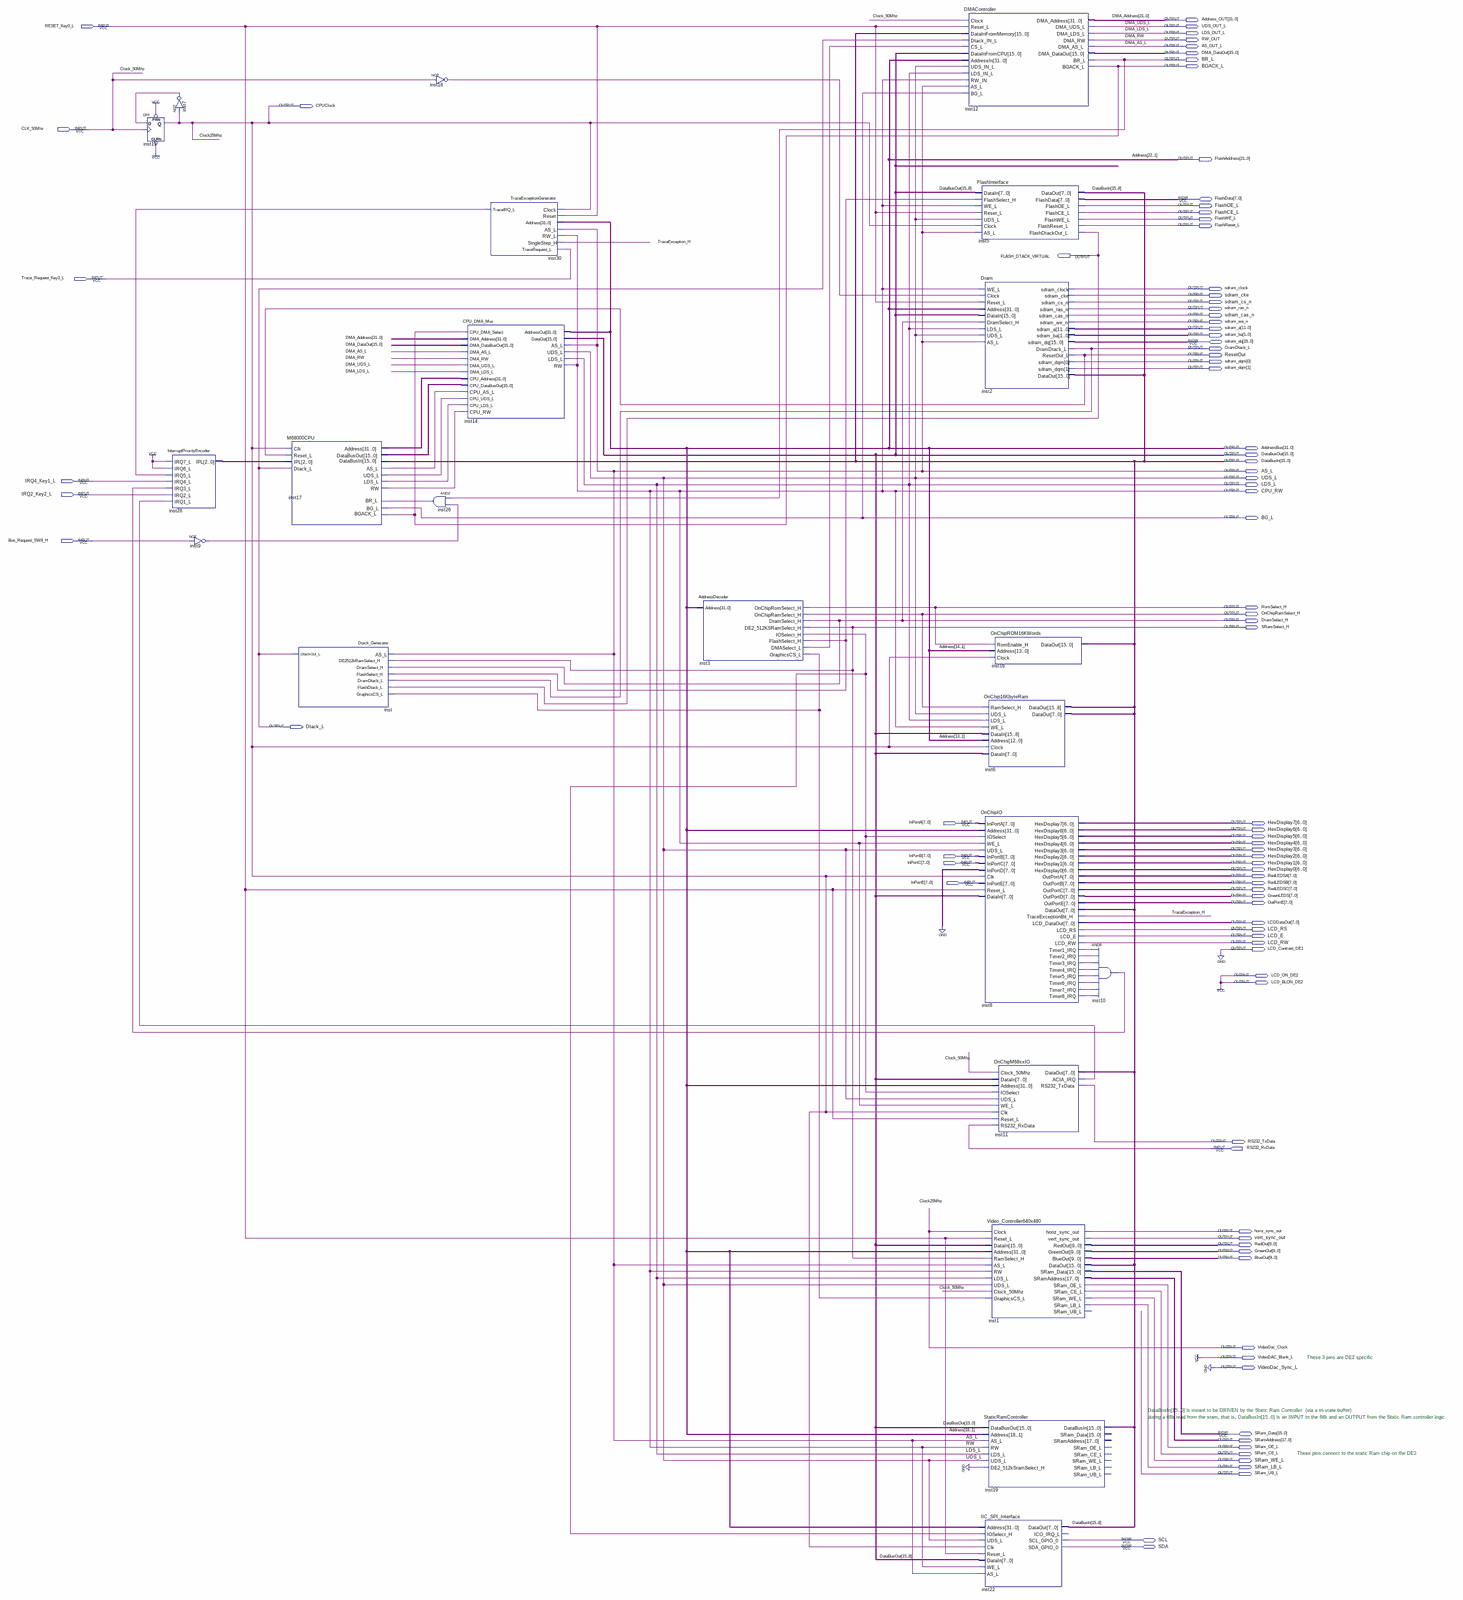
[diagram p0: schematic sheet, whole]
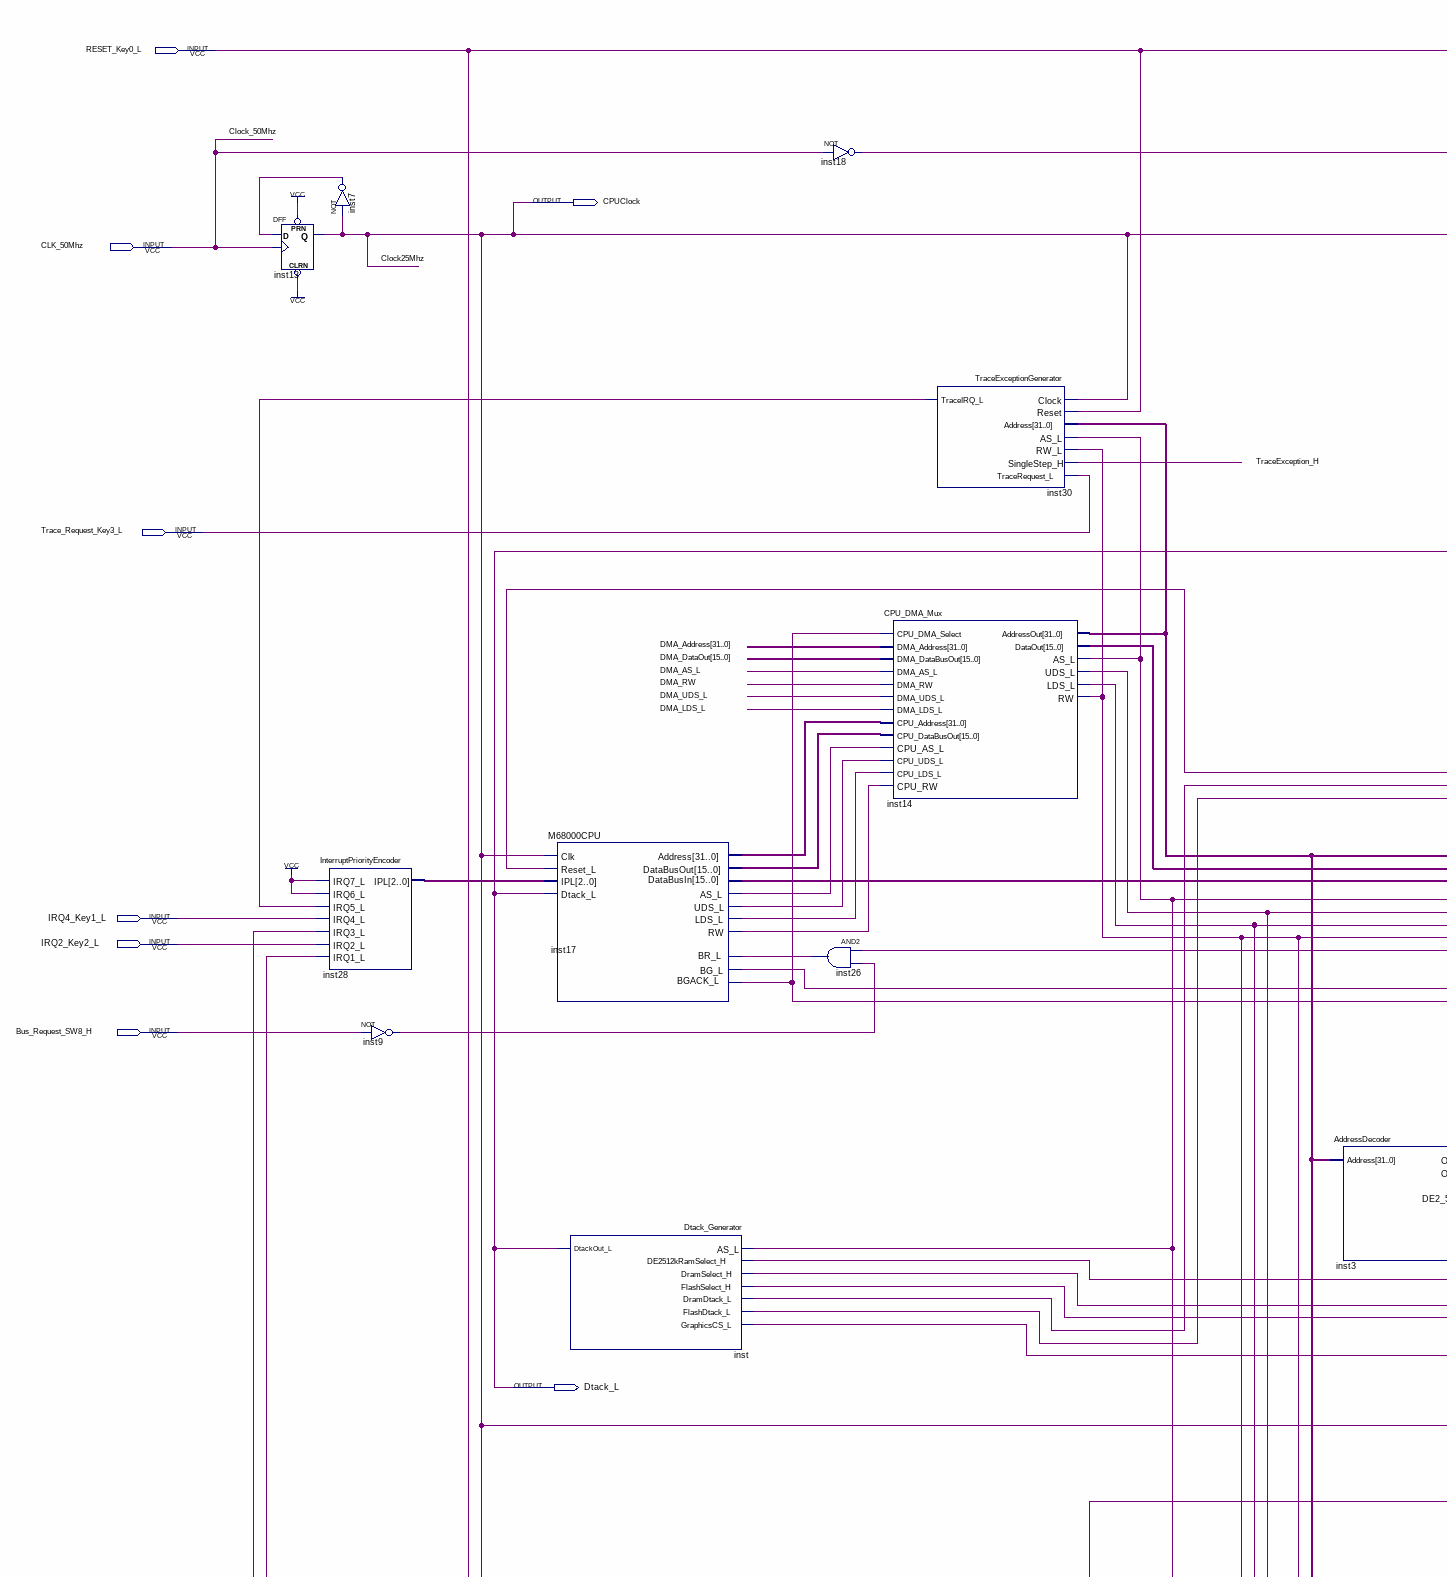
[diagram p1: schematic sheet, upper left part]
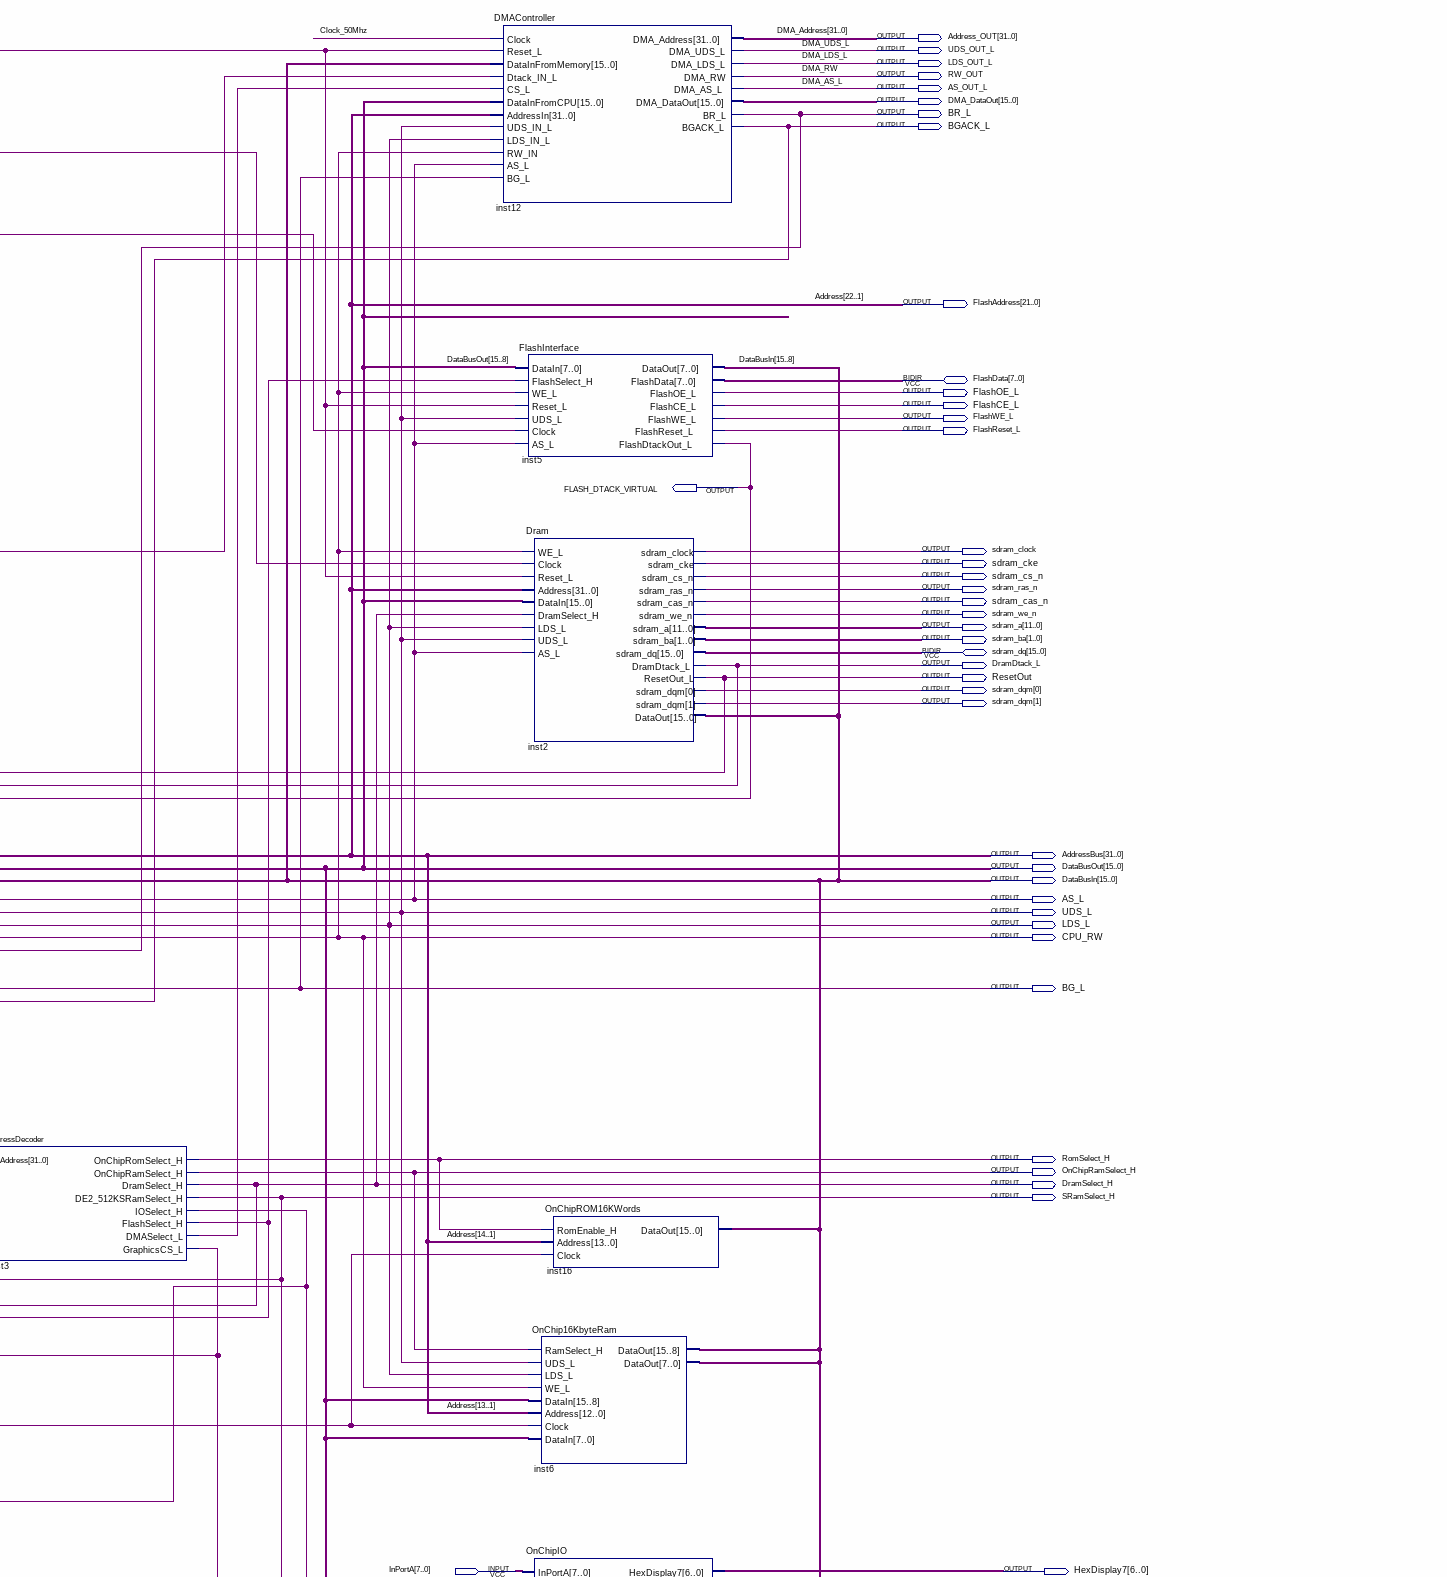
[diagram p2: schematic sheet, upper right part]
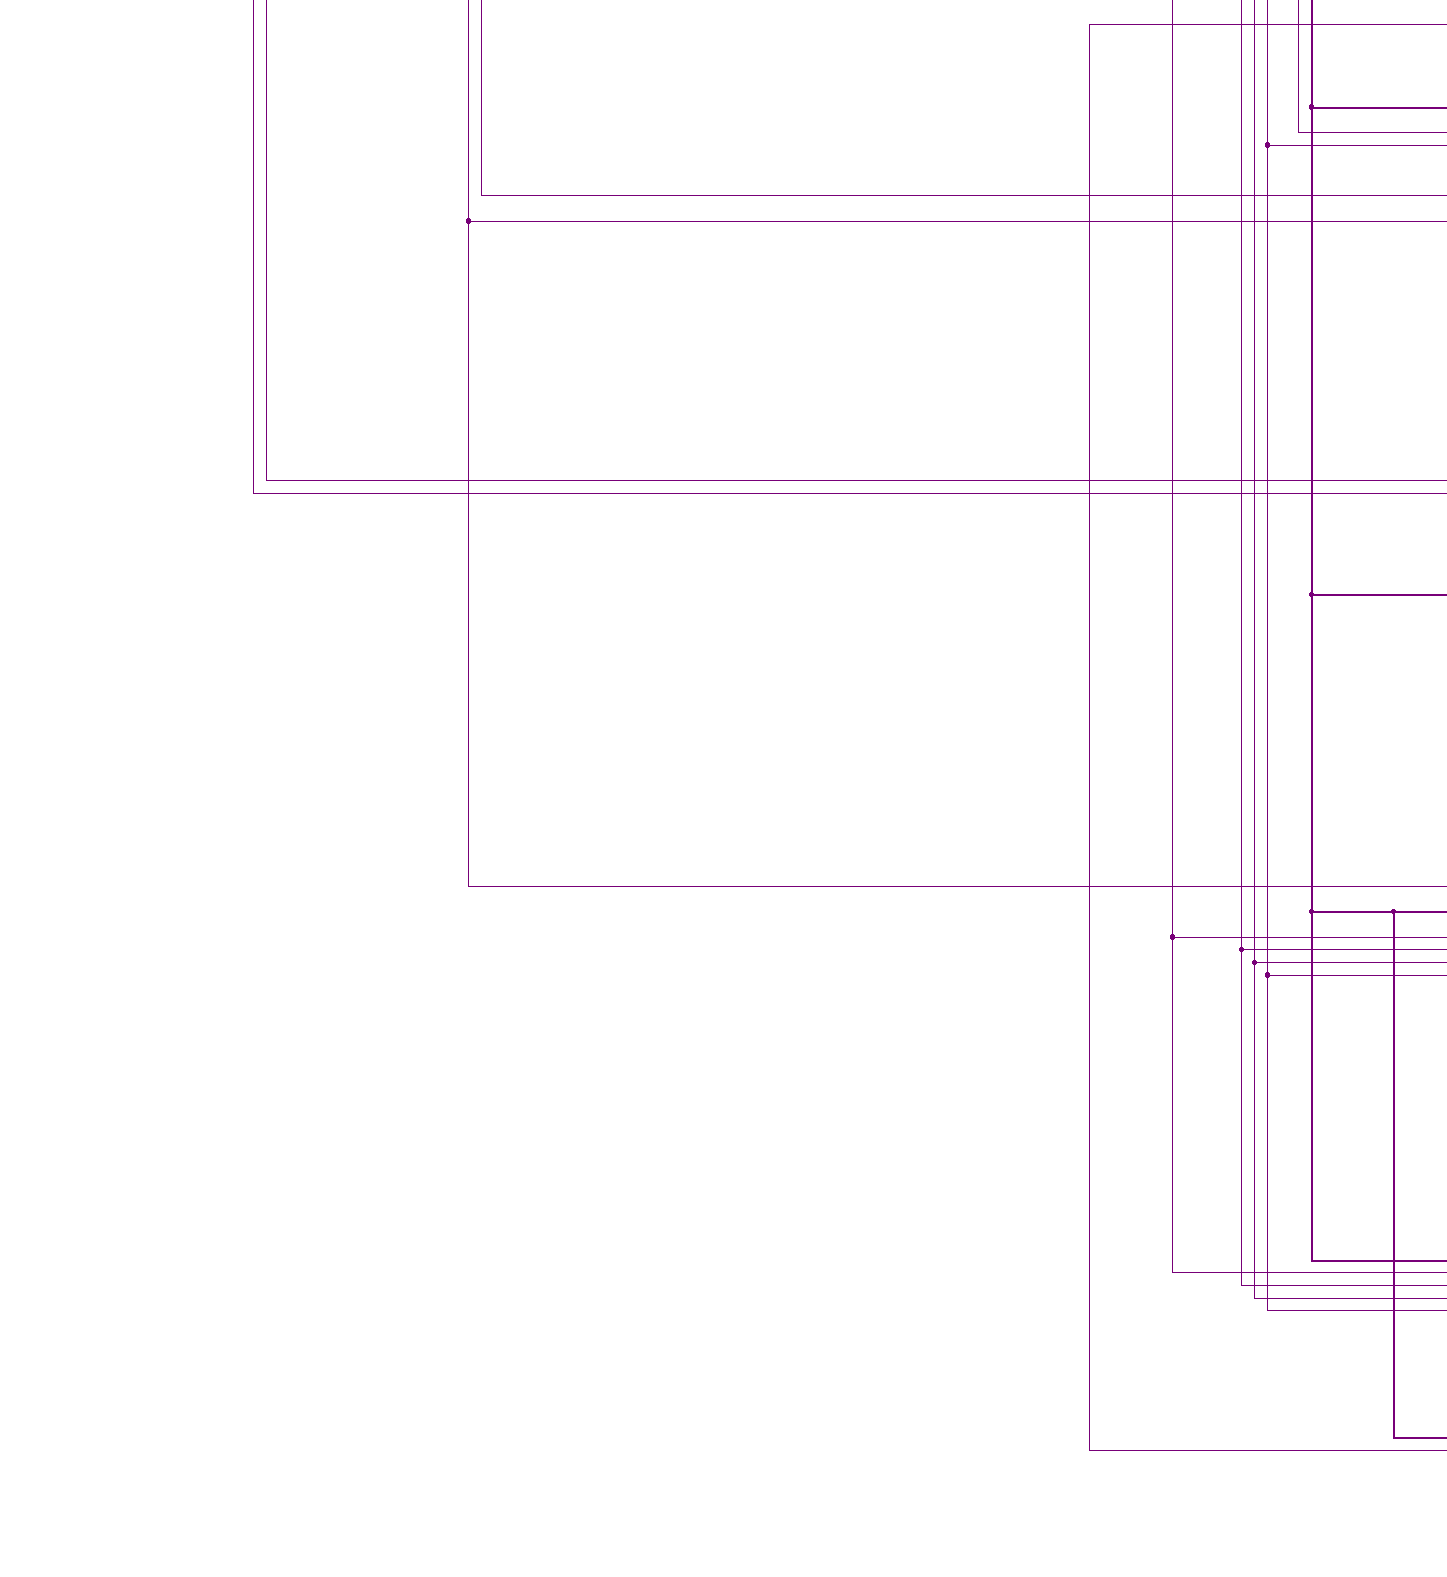
[diagram p3: schematic sheet, lower left part]
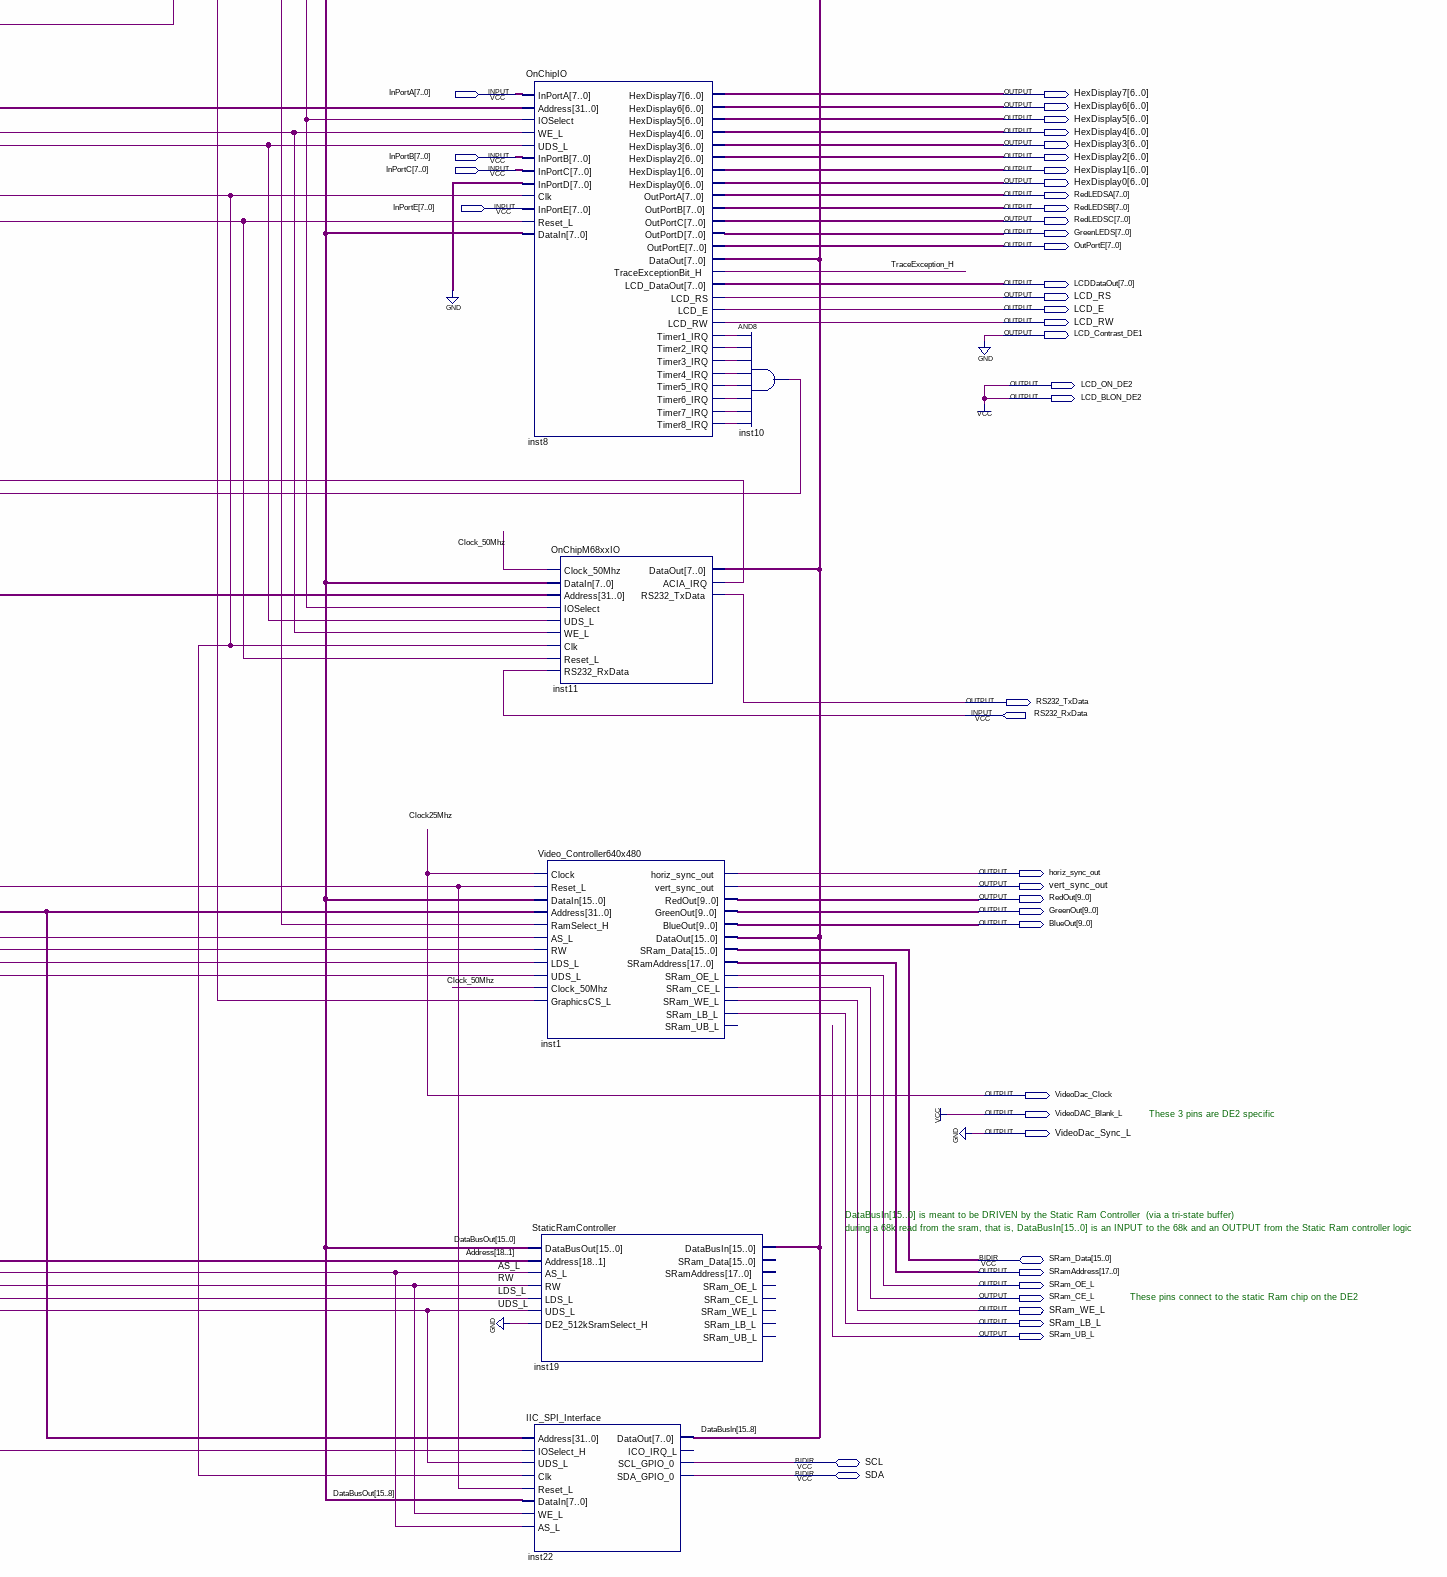
[diagram p4: schematic sheet, lower right part]
// Quartus schematic MC68K.bdf as structural Verilog: 22 symbols, 91 pins
module MC68K (
  input  RESET_Key0_L,
  input  CLK_50Mhz,
  input  Trace_Request_Key3_L,
  input  IRQ4_Key1_L,
  input  IRQ2_Key2_L,
  input  Bus_Request_SW8_H,
  input  [7:0] InPortA,
  input  [7:0] InPortB,
  input  [7:0] InPortC,
  input  [7:0] InPortE,
  input  RS232_RxData,
  inout  [7:0] FlashData,
  inout  [15:0] sdram_dq,
  inout  [15:0] SRam_Data,
  inout  SCL,
  inout  SDA,
  output [31:0] Address_OUT,
  output UDS_OUT_L,
  output LDS_OUT_L,
  output RW_OUT,
  output AS_OUT_L,
  output [15:0] DMA_DataOut,
  output BR_L,
  output BGACK_L,
  output CPUClock,
  output [21:0] FlashAddress,
  output FlashOE_L,
  output FlashCE_L,
  output FlashWE_L,
  output FlashReset_L,
  output FLASH_DTACK_VIRTUAL,
  output sdram_clock,
  output sdram_cke,
  output sdram_cs_n,
  output sdram_ras_n,
  output sdram_cas_n,
  output sdram_we_n,
  output [11:0] sdram_a,
  output [1:0] sdram_ba,
  output DramDtack_L,
  output ResetOut,
  output [1:0] sdram_dqm,
  output [31:0] AddressBus,
  output [15:0] DataBusOut,
  output [15:0] DataBusIn,
  output AS_L,
  output UDS_L,
  output LDS_L,
  output CPU_RW,
  output BG_L,
  output RomSelect_H,
  output OnChipRamSelect_H,
  output DramSelect_H,
  output SRamSelect_H,
  output Dtack_L,
  output [6:0] HexDisplay7,
  output [6:0] HexDisplay6,
  output [6:0] HexDisplay5,
  output [6:0] HexDisplay4,
  output [6:0] HexDisplay3,
  output [6:0] HexDisplay2,
  output [6:0] HexDisplay1,
  output [6:0] HexDisplay0,
  output [7:0] RedLEDSA,
  output [7:0] RedLEDSB,
  output [7:0] RedLEDSC,
  output [7:0] GreenLEDS,
  output [7:0] OutPortE,
  output [7:0] LCDDataOut,
  output LCD_RS,
  output LCD_E,
  output LCD_RW,
  output LCD_Contrast_DE1,
  output LCD_ON_DE2,
  output LCD_BLON_DE2,
  output RS232_TxData,
  output horiz_sync_out,
  output vert_sync_out,
  output [9:0] RedOut,
  output [9:0] GreenOut,
  output [9:0] BlueOut,
  output VideoDac_Clock,
  output VideoDAC_Blank_L,
  output VideoDac_Sync_L,
  output [17:0] SRamAddress,
  output SRam_OE_L,
  output SRam_CE_L,
  output SRam_WE_L,
  output SRam_LB_L,
  output SRam_UB_L
);

  wire inst3_dmaselect_l, inst3_flashselect_h, inst3_graphicscs_l, inst3_ioselect_h, inst7_out,
       inst8_timer1_irq, inst8_timer2_irq, inst8_timer3_irq, inst8_timer4_irq, inst8_timer5_irq,
       inst8_timer6_irq, inst8_timer7_irq, inst8_timer8_irq, inst9_out, inst10_out, inst11_acia_irq,
       inst17_as_l, inst17_lds_l, inst17_rw, inst17_uds_l, inst18_out, inst26_out, inst30_traceirq_l,
       TraceException_H;
  wire [2:0] inst28_ipl;
  wire [15:0] inst17_databusout;
  wire [31:0] inst17_address;

  DFF inst13 (.CLRN(1'b1), .CLK(CLK_50Mhz), .D(inst7_out), .PRN(1'b1), .Q(CPUClock));
  InterruptPriorityEncoder inst28 (
    .IRQ7_L(1'b1), .IRQ6_L(1'b1), .IRQ5_L(inst30_traceirq_l), .IRQ4_L(IRQ4_Key1_L), .IRQ3_L(inst10_out),
    .IRQ2_L(IRQ2_Key2_L), .IRQ1_L(inst11_acia_irq), .IPL(inst28_ipl));
  not inst7 (inst7_out, CPUClock);
  not inst9 (inst9_out, Bus_Request_SW8_H);
  M68000CPU inst17 (
    .DataBusIn(DataBusIn), .Clk(CPUClock), .Reset_L(ResetOut), .IPL(inst28_ipl), .Dtack_L(Dtack_L),
    .BR_L(inst26_out), .BGACK_L(BGACK_L), .Address(inst17_address), .DataBusOut(inst17_databusout),
    .AS_L(inst17_as_l), .UDS_L(inst17_uds_l), .LDS_L(inst17_lds_l), .RW(inst17_rw), .BG_L(BG_L));
  Dtack_Generator inst (
    .AS_L(AS_L), .DE2512kRamSelect_H(SRamSelect_H), .DramSelect_H(DramSelect_H),
    .FlashSelect_H(inst3_flashselect_h), .DramDtack_L(DramDtack_L), .FlashDtack_L(FLASH_DTACK_VIRTUAL),
    .GraphicsCS_L(inst3_graphicscs_l), .DtackOut_L(Dtack_L));
  not inst18 (inst18_out, CLK_50Mhz);
  and inst26 (inst26_out, BR_L, inst9_out);
  CPU_DMA_Mux inst14 (
    .CPU_DMA_Select(BGACK_L), .DMA_Address(Address_OUT), .DMA_DataBusOut(DMA_DataOut), .DMA_AS_L(AS_OUT_L),
    .DMA_RW(RW_OUT), .DMA_UDS_L(UDS_OUT_L), .DMA_LDS_L(LDS_OUT_L), .CPU_Address(inst17_address),
    .CPU_DataBusOut(inst17_databusout), .CPU_AS_L(inst17_as_l), .CPU_UDS_L(inst17_uds_l),
    .CPU_LDS_L(inst17_lds_l), .CPU_RW(inst17_rw), .AddressOut(AddressBus), .DataOut(DataBusOut), .AS_L(AS_L),
    .UDS_L(UDS_L), .LDS_L(LDS_L), .RW(CPU_RW));
  TraceExceptionGenerator inst30 (
    .Clock(CPUClock), .Reset(RESET_Key0_L), .Address(AddressBus), .AS_L(AS_L), .RW_L(CPU_RW),
    .SingleStep_H(TraceException_H), .TraceRequest_L(Trace_Request_Key3_L), .TraceIRQ_L(inst30_traceirq_l));
  AddressDecoder inst3 (
    .Address(AddressBus), .OnChipRomSelect_H(RomSelect_H), .OnChipRamSelect_H(OnChipRamSelect_H),
    .DramSelect_H(DramSelect_H), .DE2_512KSRamSelect_H(SRamSelect_H), .IOSelect_H(inst3_ioselect_h),
    .FlashSelect_H(inst3_flashselect_h), .DMASelect_L(inst3_dmaselect_l), .GraphicsCS_L(inst3_graphicscs_l));
  DMAController inst12 (
    .Clock(CLK_50Mhz), .Reset_L(RESET_Key0_L), .DataInFromMemory(DataBusIn), .Dtack_IN_L(Dtack_L),
    .CS_L(inst3_dmaselect_l), .DataInFromCPU(DataBusOut), .AddressIn(AddressBus), .UDS_IN_L(UDS_L),
    .LDS_IN_L(LDS_L), .RW_IN(CPU_RW), .AS_L(AS_L), .BG_L(BG_L), .DMA_Address(Address_OUT),
    .DMA_UDS_L(UDS_OUT_L), .DMA_LDS_L(LDS_OUT_L), .DMA_RW(RW_OUT), .DMA_AS_L(AS_OUT_L),
    .DMA_DataOut(DMA_DataOut), .BR_L(BR_L), .BGACK_L(BGACK_L));
  FlashInterface inst5 (
    .DataIn(DataBusOut[15:8]), .FlashSelect_H(inst3_flashselect_h), .WE_L(CPU_RW), .Reset_L(RESET_Key0_L),
    .UDS_L(UDS_L), .Clock(CPUClock), .AS_L(AS_L), .DataOut(DataBusIn[15:8]), .FlashOE_L(FlashOE_L),
    .FlashCE_L(FlashCE_L), .FlashWE_L(FlashWE_L), .FlashReset_L(FlashReset_L),
    .FlashDtackOut_L(FLASH_DTACK_VIRTUAL), .FlashData(FlashData));
  Dram inst2 (
    .WE_L(CPU_RW), .Clock(inst18_out), .Reset_L(RESET_Key0_L), .Address(AddressBus), .DataIn(DataBusOut),
    .DramSelect_H(DramSelect_H), .LDS_L(LDS_L), .UDS_L(UDS_L), .AS_L(AS_L), .sdram_clock(sdram_clock),
    .sdram_cke(sdram_cke), .sdram_cs_n(sdram_cs_n), .sdram_ras_n(sdram_ras_n), .sdram_cas_n(sdram_cas_n),
    .sdram_we_n(sdram_we_n), .sdram_a(sdram_a), .sdram_ba(sdram_ba), .DramDtack_L(DramDtack_L),
    .ResetOut_L(ResetOut), .sdram_dqm(sdram_dqm), .DataOut(DataBusIn), .sdram_dq(sdram_dq));
  OnChipROM16KWords inst16 (
    .RomEnable_H(RomSelect_H), .Address(AddressBus[14:1]), .Clock(CPUClock), .DataOut(DataBusIn));
  OnChip16KbyteRam inst6 (
    .RamSelect_H(OnChipRamSelect_H), .UDS_L(UDS_L), .LDS_L(LDS_L), .WE_L(CPU_RW), .DataIn(DataBusOut),
    .Address(AddressBus[13:1]), .Clock(CPUClock), .DataOut(DataBusIn));
  OnChipIO inst8 (
    .InPortA(InPortA), .Address(AddressBus), .IOSelect(inst3_ioselect_h), .WE_L(CPU_RW), .UDS_L(UDS_L),
    .InPortB(InPortB), .InPortC(InPortC), .InPortD({8{1'b0}}), .Clk(CPUClock), .InPortE(InPortE),
    .Reset_L(RESET_Key0_L), .DataIn(DataBusOut[15:8]), .HexDisplay7(HexDisplay7), .HexDisplay6(HexDisplay6),
    .HexDisplay5(HexDisplay5), .HexDisplay4(HexDisplay4), .HexDisplay3(HexDisplay3),
    .HexDisplay2(HexDisplay2), .HexDisplay1(HexDisplay1), .HexDisplay0(HexDisplay0), .OutPortA(RedLEDSA),
    .OutPortB(RedLEDSB), .OutPortC(RedLEDSC), .OutPortD(GreenLEDS), .OutPortE(OutPortE),
    .DataOut(DataBusIn[15:8]), .TraceExceptionBit_H(TraceException_H), .LCD_DataOut(LCDDataOut),
    .LCD_RS(LCD_RS), .LCD_E(LCD_E), .LCD_RW(LCD_RW), .Timer1_IRQ(inst8_timer1_irq),
    .Timer2_IRQ(inst8_timer2_irq), .Timer3_IRQ(inst8_timer3_irq), .Timer4_IRQ(inst8_timer4_irq),
    .Timer5_IRQ(inst8_timer5_irq), .Timer6_IRQ(inst8_timer6_irq), .Timer7_IRQ(inst8_timer7_irq),
    .Timer8_IRQ(inst8_timer8_irq));
  OnChipM68xxIO inst11 (
    .Clock_50Mhz(CLK_50Mhz), .DataIn(DataBusOut[15:8]), .Address(AddressBus), .IOSelect(inst3_ioselect_h),
    .UDS_L(UDS_L), .WE_L(CPU_RW), .Clk(CPUClock), .Reset_L(RESET_Key0_L), .RS232_RxData(RS232_RxData),
    .DataOut(DataBusIn[15:8]), .ACIA_IRQ(inst11_acia_irq), .RS232_TxData(RS232_TxData));
  Video_Controller640x480 inst1 (
    .Clock(CPUClock), .Reset_L(RESET_Key0_L), .DataIn(DataBusOut), .Address(AddressBus),
    .RamSelect_H(SRamSelect_H), .AS_L(AS_L), .RW(CPU_RW), .LDS_L(LDS_L), .UDS_L(UDS_L),
    .Clock_50Mhz(CLK_50Mhz), .GraphicsCS_L(inst3_graphicscs_l), .horiz_sync_out(horiz_sync_out),
    .vert_sync_out(vert_sync_out), .RedOut(RedOut), .GreenOut(GreenOut), .BlueOut(BlueOut),
    .DataOut(DataBusIn), .SRamAddress(SRamAddress), .SRam_OE_L(SRam_OE_L), .SRam_CE_L(SRam_CE_L),
    .SRam_WE_L(SRam_WE_L), .SRam_LB_L(SRam_LB_L), .SRam_Data(SRam_Data));  // open: SRam_UB_L
  StaticRamController inst19 (
    .DataBusOut(DataBusOut), .Address(AddressBus[18:1]), .AS_L(AS_L), .RW(CPU_RW), .LDS_L(LDS_L),
    .UDS_L(UDS_L), .DE2_512kSramSelect_H(1'b0), .DataBusIn(DataBusIn));  // open: SRamAddress, SRam_OE_L, SRam_CE_L, SRam_WE_L, SRam_LB_L, SRam_UB_L, SRam_Data
  IIC_SPI_Interface inst22 (
    .Address(AddressBus), .IOSelect_H(inst3_ioselect_h), .UDS_L(UDS_L), .Clk(CPUClock),
    .Reset_L(RESET_Key0_L), .DataIn(DataBusOut[15:8]), .WE_L(CPU_RW), .AS_L(AS_L), .DataOut(DataBusIn[15:8]),
    .SCL_GPIO_0(SCL), .SDA_GPIO_0(SDA));  // open: ICO_IRQ_L
  and inst10 (inst10_out, inst8_timer1_irq, inst8_timer2_irq, inst8_timer3_irq, inst8_timer4_irq, inst8_timer5_irq, inst8_timer6_irq, inst8_timer7_irq, inst8_timer8_irq);

  assign FlashAddress = AddressBus[22:1];
  assign LCD_BLON_DE2 = 1'b1;
  assign LCD_Contrast_DE1 = 1'b0;
  assign LCD_ON_DE2 = 1'b1;
  assign VideoDAC_Blank_L = 1'b1;
  assign VideoDac_Clock = CPUClock;
  assign VideoDac_Sync_L = 1'b0;

  // Other names for the same wires on the sheet: Address[31:0] = AddressBus; Clock_50Mhz = CLK_50Mhz; RW = CPU_RW;
  //   Clock25Mhz = CPUClock; DMA_Address[31:0] = Address_OUT; DMA_AS_L = AS_OUT_L; DMA_LDS_L = LDS_OUT_L;
  //   DMA_RW = RW_OUT; DMA_UDS_L = UDS_OUT_L

  // Notes on the sheet:
  //   These 3 pins are DE2 specific
  //   DataBusIn[15..0] is meant to be DRIVEN by the Static Ram Controller  (via a tri-state buffer)
  //   during a 68k read from the sram, that is, DataBusIn[15..0] is an INPUT to the 68k and an OUTPUT from the Static Ram controller logic
  //   These pins connect to the static Ram chip on the DE2
endmodule
